# Altium schematic sheet VAMoS Top Sheet.SchDoc
size A4; DocumentNumber: 1; SheetNumber: 1; SheetTotal: 7
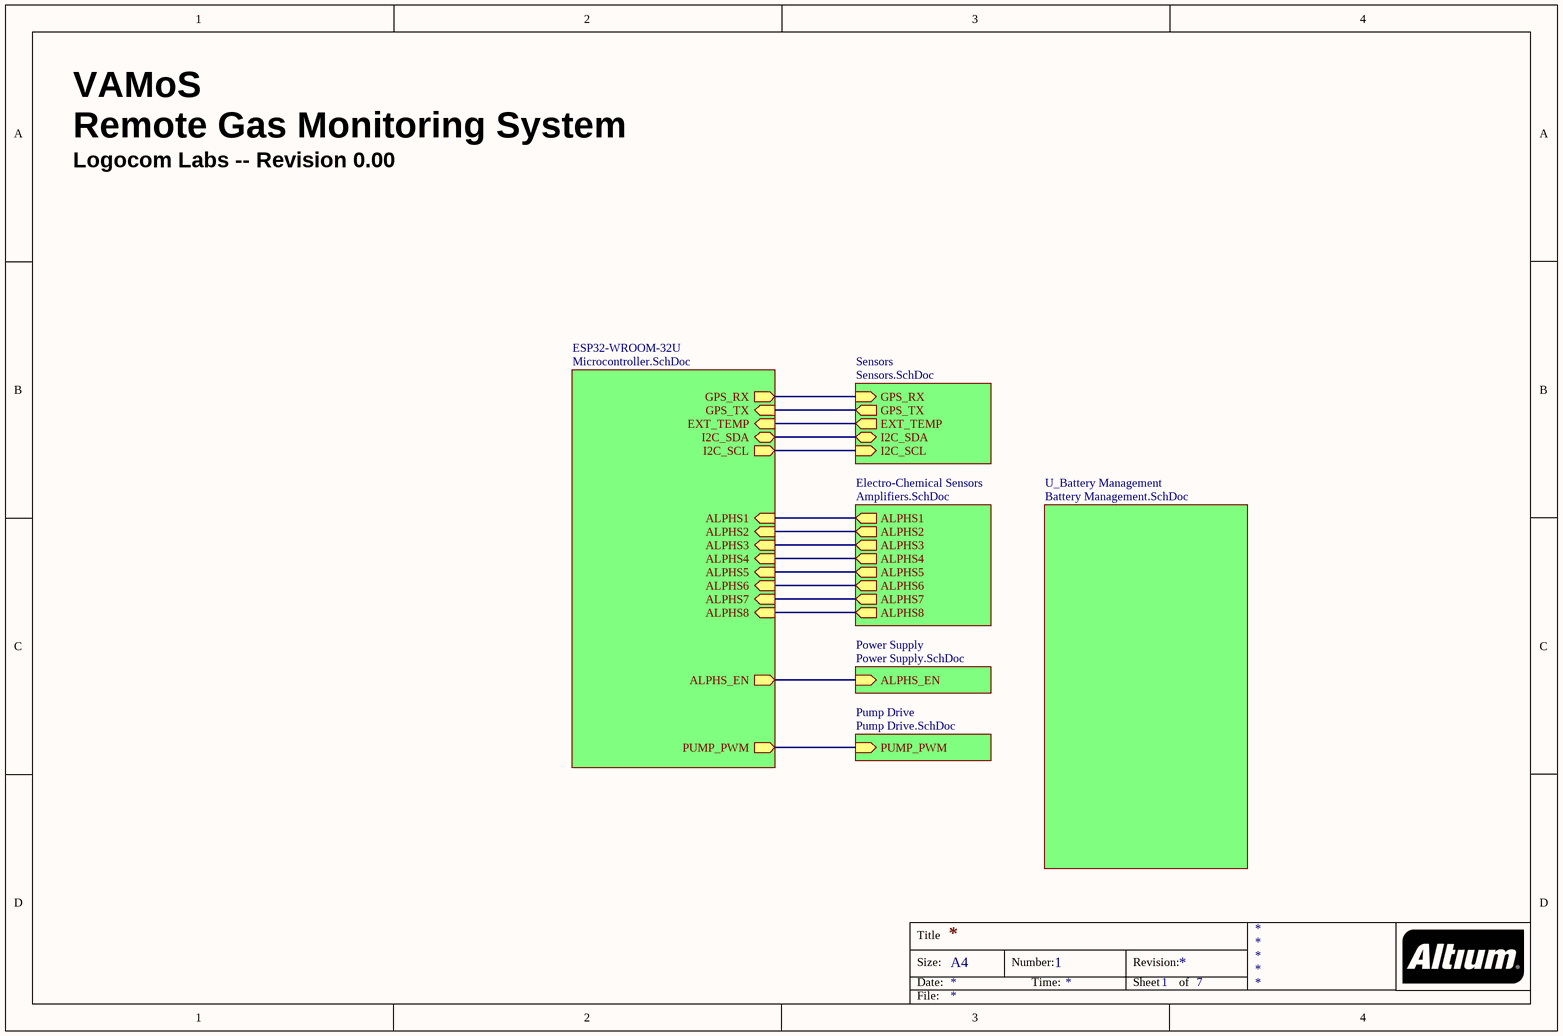
[diagram p0: VAMoS Top Sheet.SchDoc]

## Sub-sheets
Electro-Chemical Sensors = Amplifiers.SchDoc: ALPHS1 (out), ALPHS2 (out), ALPHS3 (out), ALPHS4 (out), ALPHS5 (out), ALPHS6 (out), ALPHS7 (out), ALPHS8 (out)
ESP32-WROOM-32U = Microcontroller.SchDoc: I2C_SDA (bidir), I2C_SCL (out), GPS_TX (in), GPS_RX (out), EXT_TEMP (in), ALPHS_EN (out), PUMP_PWM (out), ALPHS8 (in), ALPHS1 (in), ALPHS2 (in), ALPHS3 (in), ALPHS4 (in), ALPHS5 (in), ALPHS6 (in), ALPHS7 (in)
Power Supply = Power Supply.SchDoc: ALPHS_EN (in)
Pump Drive = Pump Drive.SchDoc: PUMP_PWM (in)
Sensors = Sensors.SchDoc: GPS_RX (in), GPS_TX (out), EXT_TEMP (out), I2C_SDA (bidir), I2C_SCL (in)
U_Battery Management = Battery Management.SchDoc: no entries

## Nets
(unnamed): sheet Sensors/GPS_RX, sheet ESP32-WROOM-32U/GPS_RX
(unnamed): sheet Sensors/GPS_TX, sheet ESP32-WROOM-32U/GPS_TX
(unnamed): sheet Sensors/EXT_TEMP, sheet ESP32-WROOM-32U/EXT_TEMP
(unnamed): sheet Sensors/I2C_SDA, sheet ESP32-WROOM-32U/I2C_SDA
(unnamed): sheet Sensors/I2C_SCL, sheet ESP32-WROOM-32U/I2C_SCL
(unnamed): sheet Electro-Chemical Sensors/ALPHS1, sheet ESP32-WROOM-32U/ALPHS1
(unnamed): sheet Electro-Chemical Sensors/ALPHS2, sheet ESP32-WROOM-32U/ALPHS2
(unnamed): sheet Electro-Chemical Sensors/ALPHS3, sheet ESP32-WROOM-32U/ALPHS3
(unnamed): sheet Electro-Chemical Sensors/ALPHS4, sheet ESP32-WROOM-32U/ALPHS4
(unnamed): sheet Electro-Chemical Sensors/ALPHS5, sheet ESP32-WROOM-32U/ALPHS5
(unnamed): sheet Electro-Chemical Sensors/ALPHS6, sheet ESP32-WROOM-32U/ALPHS6
(unnamed): sheet Electro-Chemical Sensors/ALPHS7, sheet ESP32-WROOM-32U/ALPHS7
(unnamed): sheet Electro-Chemical Sensors/ALPHS8, sheet ESP32-WROOM-32U/ALPHS8
(unnamed): sheet Power Supply/ALPHS_EN, sheet ESP32-WROOM-32U/ALPHS_EN
(unnamed): sheet ESP32-WROOM-32U/PUMP_PWM, sheet Pump Drive/PUMP_PWM

## Notes on the sheet
- VAMoS
- Remote Gas Monitoring System
- Logocom Labs -- Revision 0.00
- Title
- Size:
- Date:
- A4
- Number:
- Time:
- Revision:
- Sheet
- of
- File: